# EAGLE design RS232 (EAGLE 5.04)
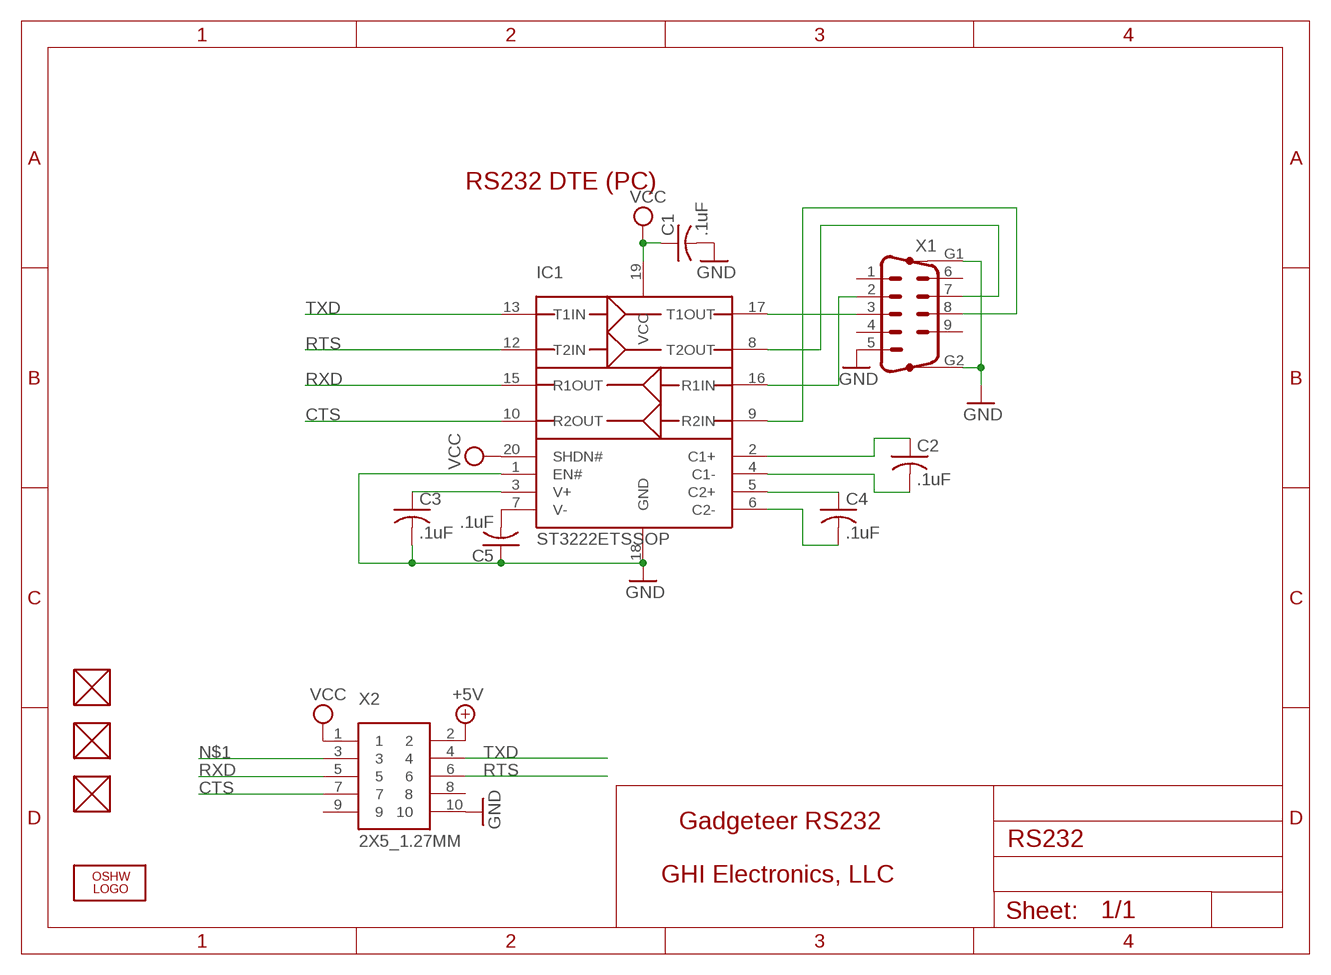
[diagram p0: schematic, sheet 1]

## Parts
C1  .1uF  C-USC0603K  [C0603K]
C2  .1uF  C-USC0603K  [C0603K]
C3  .1uF  C-USC0603K  [C0603K]
C4  .1uF  C-USC0603K  [C0603K]
C5  .1uF  C-USC0603K  [C0603K]
FUD1  FIDUCIAL  [FIDUCIAL_40MIL]
FUD2  FIDUCIAL  [FIDUCIAL_40MIL]
FUD3  FIDUCIAL  [FIDUCIAL_40MIL]
IC1  ST3222ETSSOP  [TSSOP20]
LOGO  LOGO-OSHW-FILLX0200-NT  [OSHW_FILLX200_NOTEXT]
X1  M09HP  [M09HP]
X2  2X5_1.27MM  [2X5_1.27MM]

## Nets
+5V [power]: X2.2
CTS: IC1.10(R2OUT) X2.7
GND [power]: C1.2 C3.2 C5.1 IC1.1(EN#) IC1.18(GND) X1.5 X1.G1 X1.G2 X2.10
N$1: X2.3
N$30: C2.2 IC1.4(C1-)
N$33: C2.1 IC1.2(C1+)
N$34: C4.1 IC1.5(C2+)
N$35: C4.2 IC1.6(C2-)
N$37: C3.1 IC1.3(V+)
N$41: IC1.8(T2OUT) X1.7
N$42: IC1.9(R2IN) X1.8
N$44: IC1.17(T1OUT) X1.3
N$47: C5.2 IC1.7(V-)
RS232_RX: IC1.16(R1IN) X1.2
RTS: IC1.12(T2IN) X2.6
RXD: IC1.15(R1OUT) X2.5
TXD: IC1.13(T1IN) X2.4
VCC [power]: C1.1 IC1.19(VCC) IC1.20(SHDN#) X2.1
Unconnected: FUD1.P$1 FUD2.P$1 FUD3.P$1 X1.1 X1.4 X1.6 X1.9 X2.8 X2.9

## Notes on the sheet
- RS232 DTE (PC)
- Gadgeteer RS232
- GHI Electronics, LLC

## Library data of the parts
C1-C5 = rcl:C-US: CAPACITOR, American symbol
FUD1-FUD3 = GHI:FIDUCIAL
IC1 = GHI:ST3222E
LOGO = Logo:LOGO-OSHW-FILL
X1 = con-subd:M09HP: SUB-D
X2 = GHI:2X5_1.27MM

## Net classes
0 default: width 0.254 mm, drill 0.381 mm, clearance 0.203 mm

## Board
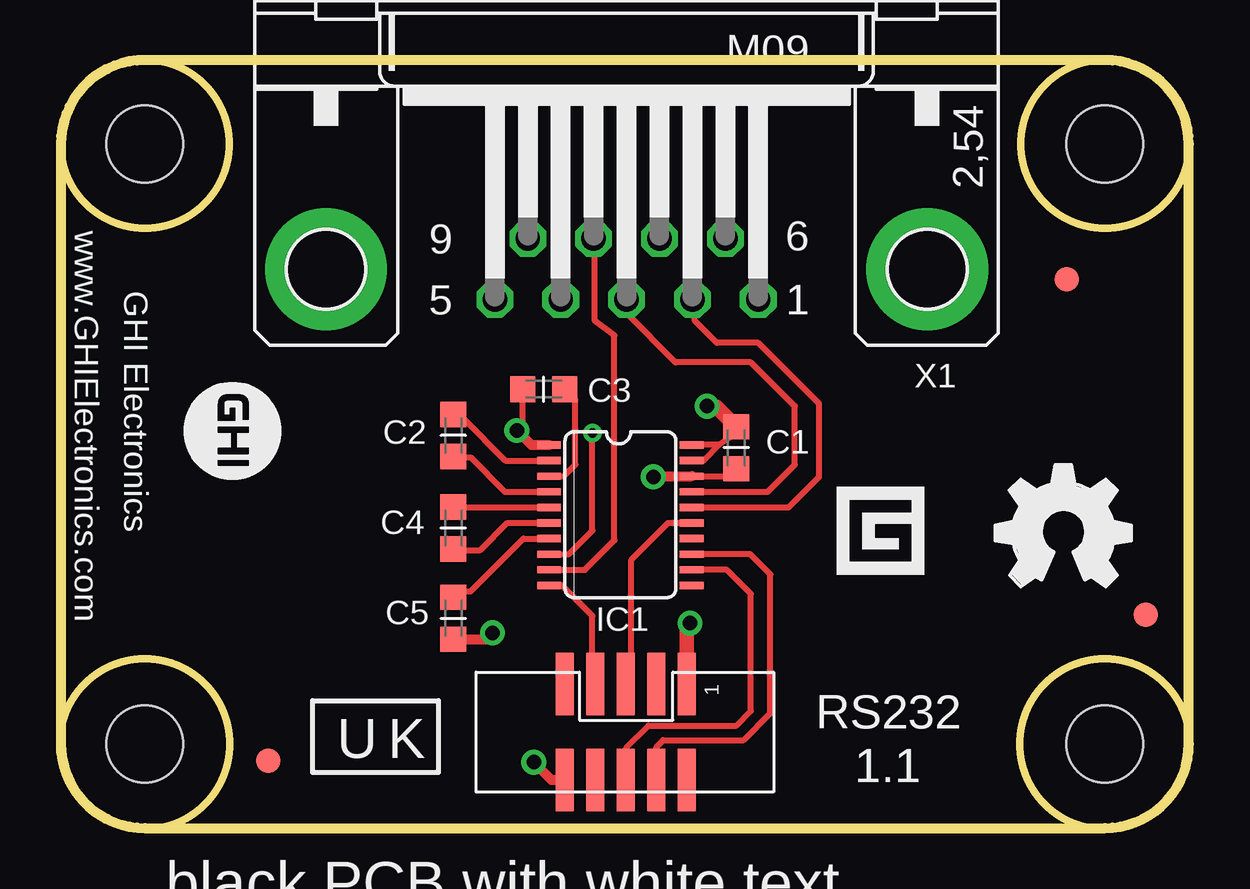
[diagram p1: board, top side]
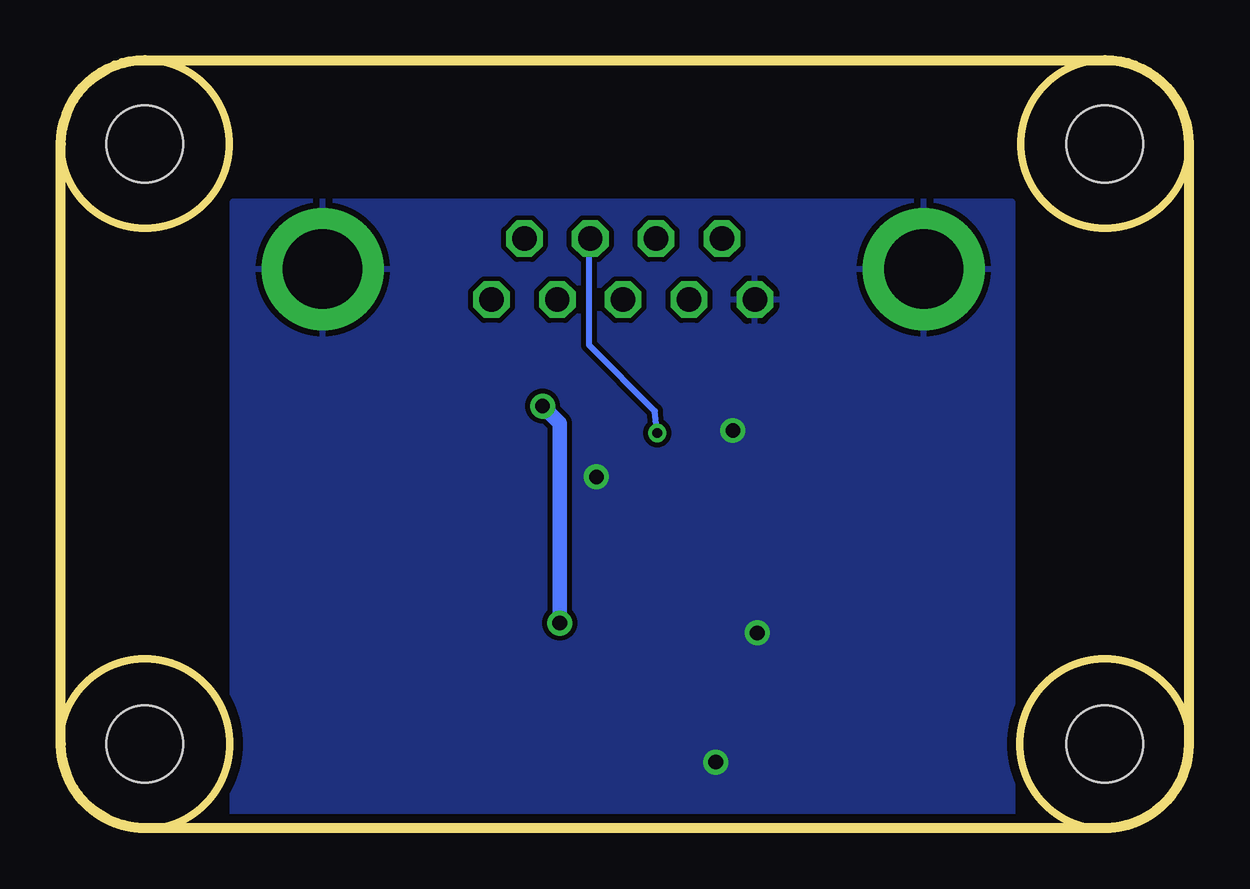
[diagram p2: board, bottom side, seen from below]

Size 47.07 x 32.04 mm. Coordinates in mm from the lower left corner, seen from the top.
Outline: 43.54,0.04 arc90 47.04,3.54 47.04,28.54 arc90 43.54,32.04 3.54,32.04 arc90 0.04,28.54 0.04,3.54 arc90 3.54,0.04 43.54,0.04
Outline: circle at 3.54,28.54 radius 3.5
Outline: circle at 43.54,28.54 radius 3.5
Outline: circle at 43.54,3.54 radius 3.54
Outline: circle at 3.54,3.54 radius 3.54
Copper layers (1+16): Top 0.035mm / dielectric 1.5mm / Bottom 0.035mm
Design rules "default *": minimum track width 8mil, minimum drill 12mil, track to track 8mil, track to pad 8mil, pad to pad 8mil, via to via 8mil, smd to smd 8mil, copper to edge 15mil, drill to drill 8mil, minimum pad ring 10mil, minimum via ring 7mil, stop-mask expansion 4mil, vias tented up to drill 50mil, thermal gap 10mil
Holes 3.2 mm at 3.54,3.54 43.54,28.54 3.54,28.54 43.54,3.54

### Footprints (pad centres in the part's own frame; a part is rotated, then mirrored left to right if it is on the bottom)
C0603K = smd 1.05 x 1.08: 1 -0.875,0; 2 0.875,0
FIDUCIAL_40MIL = smd 1.016 x 1.016: P$1 0,0
TSSOP20 = smd 0.305 x 0.991: 1 -2.955,-2.721; 2 -2.305,-2.721; 3 -1.655,-2.721; 4 -1.005,-2.721; 5 -0.355,-2.721; 6 0.295,-2.721; 7 0.945,-2.721; 8 1.595,-2.721; 9 2.245,-2.721; 10 2.895,-2.721; 11 2.895,3.229; 12 2.245,3.229; 13 1.595,3.229; 14 0.945,3.229; 15 0.295,3.229; 16 -0.355,3.229; 17 -1.005,3.229; 18 -1.655,3.229; 19 -2.305,3.229; 20 -2.955,3.229
M09HP = drill 1.016 octagon: 1 -5.486,1.27; 2 -2.743,1.27; 3 0,1.27; 4 2.743,1.27; 5 5.486,1.27; 6 -4.115,-1.27; 7 -1.372,-1.27; 8 1.372,-1.27; 9 4.115,-1.27 | drill 3.302 pad 5.08 round: G1 -12.522,0; G2 12.522,0
2X5_1.27MM = smd 2.6 x 0.74: 1 -2,2.58; 2 2,2.58; 3 -2,1.31; 4 2,1.31; 5 -2,0.04; 6 2,0.04; 7 -2,-1.23; 8 2,-1.23; 9 -2,-2.5; 10 2,-2.5

### Placement (x,y rotation side)
C1  28.18,15.89 270 top
C2  16.39,16.39 270 top
C3  20.15,18.32 180 top
C4  16.39,12.53 270 top
C5  16.39,8.77 90 top
FUD1  8.67,2.83 0 top
FUD2  45.25,8.93 0 top
FUD3  41.95,22.9 0 top
IC1  23.1,13.04 270 top
LOGO  38.97,10.09 0 top
X1  23.61,23.32 180 top
X2  23.54,4.04 270 top

### Tracks (layer width: path | path; a pad name or v marks a point on that pad's centre or on a via)
CTS
  Top 0.254: IC1.10 20.91,10.15 22.18,8.87 22.18,6.16 X2.7
GND  (via drill 0.61)
  Top 0.254: IC1.18 28.05,14.7 28.08,14.87 28.55,14.97 C1.2 | v19.03,16.6 19.28,16.84 C3.2
  Top 0.406: X2.10 20.49,2.04 v19.75,2.78 | IC1.1 19.64,16 19.26,16.37 19.24,16.39 v19.03,16.6 | IC1.18 24.75,14.7 v24.72,14.67 | C5.1 17.75,7.9 v18.02,8.16
  pour Bottom: 7.4,26.15 7.4,0.54 39.86,0.54 39.86,26.15
N$30
  Top 0.254: IC1.4 18.54,14.05 17.1,15.48 16.43,15.48 C2.2
N$33
  Top 0.254: IC1.2 18.56,15.35 16.8,17.1 16.56,17.1 C2.1
N$34
  Top 0.254: IC1.5 C4.1
N$35
  Top 0.254: IC1.6 18.64,12.75 17.51,11.62 16.43,11.62 C4.2
N$37
  Top 0.254: IC1.3 20.99,14.7 21.47,15.17 21.47,17.88 C3.1
N$41  (via drill 0.41)
  Top 0.254: IC1.8 21.2,11.45 22.18,12.43 v22.18,16.49
  Bottom 0.254: v22.18,16.49 22.29,17.41 25.03,20.15 25.03,24.54 X1.7
N$42
  Top 0.254: IC1.9 21.87,10.8 23.1,12.02 23.1,20.56 22.29,21.17 22.29,24.54 X1.8
N$44
  Top 0.254: IC1.17 29.49,14.05 30.62,15.17 30.62,17.61 28.79,19.44 25.64,19.44 23.61,21.47 X1.3
N$47
  Top 0.254: IC1.7 19.31,12.1 17.1,9.89 16.64,9.89 C5.2
RS232_RX
  Top 0.254: IC1.16 30.36,13.4 31.63,14.67 31.63,17.71 29.09,20.25 27.37,20.25 26.45,21.17 26.45,21.95 X1.2
RTS
  Top 0.254: X2.6 23.58,3.36 24.52,4.3 28.18,4.3 28.79,4.91 28.79,9.79 27.78,10.8 IC1.12
RXD
  Top 0.254: IC1.15 25.34,12.75 23.81,11.21 23.81,6.27 X2.5
TXD
  Top 0.254: X2.4 24.85,3.41 25.13,3.69 28.48,3.69 29.6,4.81 29.6,10.6 28.76,11.45 IC1.13
VCC  (via drill 0.61)
  Top 0.254: 27.47,16 IC1.20 | 27.47,16 28.23,16.5 C1.1 | IC1.19 26.82,15.35 27.47,16
  Top 0.61: X2.1 26.12,8.44 v26.25,8.57 | v26.96,17.61 27.33,17.61 C1.1
  Bottom 0.61: v26.25,8.57 26.25,16.9 v26.96,17.61

### Text on the board
tPlace: www.GHIElectronics.com | GHI Electronics | RS232 | U | K | 1.1 | black PCB with white text | corner holes are nonplated | do not add manufacturing codes